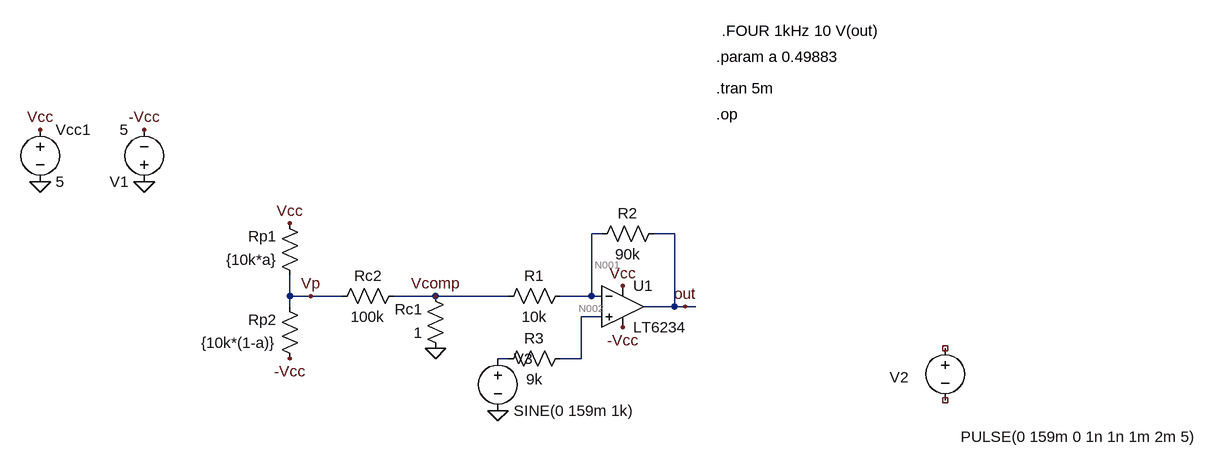
[diagram p0: schematic Transient_etaj1.asc]
* Transient_etaj1.asc
Vcc1 Vcc 0 5
V1 0 -Vcc 5
* U1: LT6234 (symbol OpAmps\LT6234 not available, pins judged from their places): In+=N002 In-=N001 V+=Vcc V-=-Vcc OUT=out
R1 N001 Vcomp 10k
R2 out N001 90k
R3 N002 N003 9k
Rc1 0 Vcomp 1
Rc2 Vcomp Vp 100k
Rp1 Vp Vcc {10k*a}
Rp2 -Vcc Vp {10k*(1-a)}
V2 NC_01 NC_02 PULSE(0 159m 0 1n 1n 1m 2m 5)
V3 N003 0 SINE(0 159m 1k)
.op
.tran 5m
.param a 0.49883
.FOUR 1kHz 10 V(out)
.backanno
.end

* Results of the author's LTspice run, read from the files saved beside the schematic
* Operating Point, zero values left out:
*   V(vcc) = 5 V
*   V(-vcc) = -5 V
*   V(out) = -5.337 nV
*   V(n002) = -13.49 mV
*   V(n001) = -13.5 mV
*   V(vcomp) = -1.235 µV
*   V(vp) = 11.41 mV
*   I(R1) = -1.349 µA
*   I(R2) = 149.9 nA
*   I(R3) = -1.499 µA
*   I(Rc1) = 1.235 µA
*   I(Rc2) = -114.2 nA
*   I(Rp1) = -1 mA
*   I(Rp2) = -999.9 µA
*   I(Vcc1) = -2.04 mA
*   I(V1) = -2.043 mA
*   I(V3) = -1.499 µA
*   Ix(u1:1) = 1.499 µA
*   Ix(u1:2) = 1.499 µA
*   Ix(u1:3) = -149.9 nA
*   Ix(u1:4) = 1.04 mA
*   Ix(u1:5) = -1.043 mA
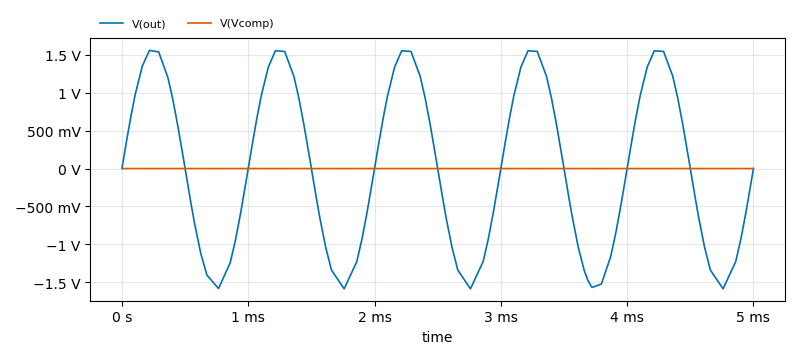
[diagram p1: Transient Analysis of Transient_etaj1.asc, plotted from the saved traces]
* Transient Analysis, 1 run:
*   V(out): min -1.585 V, max 1.557 V, average 3.639 mV, rms 1.11 V, last -479.3 µV
*   V(Vcomp): min -17.08 µV, max 14.33 µV, average -1.199 µV, rms 11.16 µV, last -1.241 µV
* From the log:
*   N-Period=1
*   Fourier components of V(out)
*   DC component:-5.91649e-05
*   Harmonic  Frequency   Fourier   Normalized   Phase    Normalized
*    Number     [Hz]     Component   Component  [degree]  Phase [deg]
*       1      1.000e+3   1.590e+0   1.000e+0     90.02°      0.00°
*       2      2.000e+3   1.678e-4   1.055e-4     35.72°    -54.30°
*       3      3.000e+3   7.698e-4   4.843e-4     46.69°    -43.34°
*       4      4.000e+3   2.238e-4   1.408e-4   -171.54°   -261.56°
*       5      5.000e+3   7.512e-4   4.726e-4   -140.52°   -230.55°
*       6      6.000e+3   1.816e-4   1.142e-4    -76.35°   -166.38°
*       7      7.000e+3   5.853e-4   3.682e-4     78.93°    -11.09°
*       8      8.000e+3   4.606e-4   2.898e-4     15.98°    -74.04°
*       9      9.000e+3   6.713e-4   4.223e-4    -36.26°   -126.29°
*      10      1.000e+4   5.205e-4   3.274e-4    131.77°     41.74°
*   Partial Harmonic Distortion: 0.100353%
*   Total Harmonic Distortion:   0.112898%